# Altium project STM32_ExamplePCB.PrjPcb
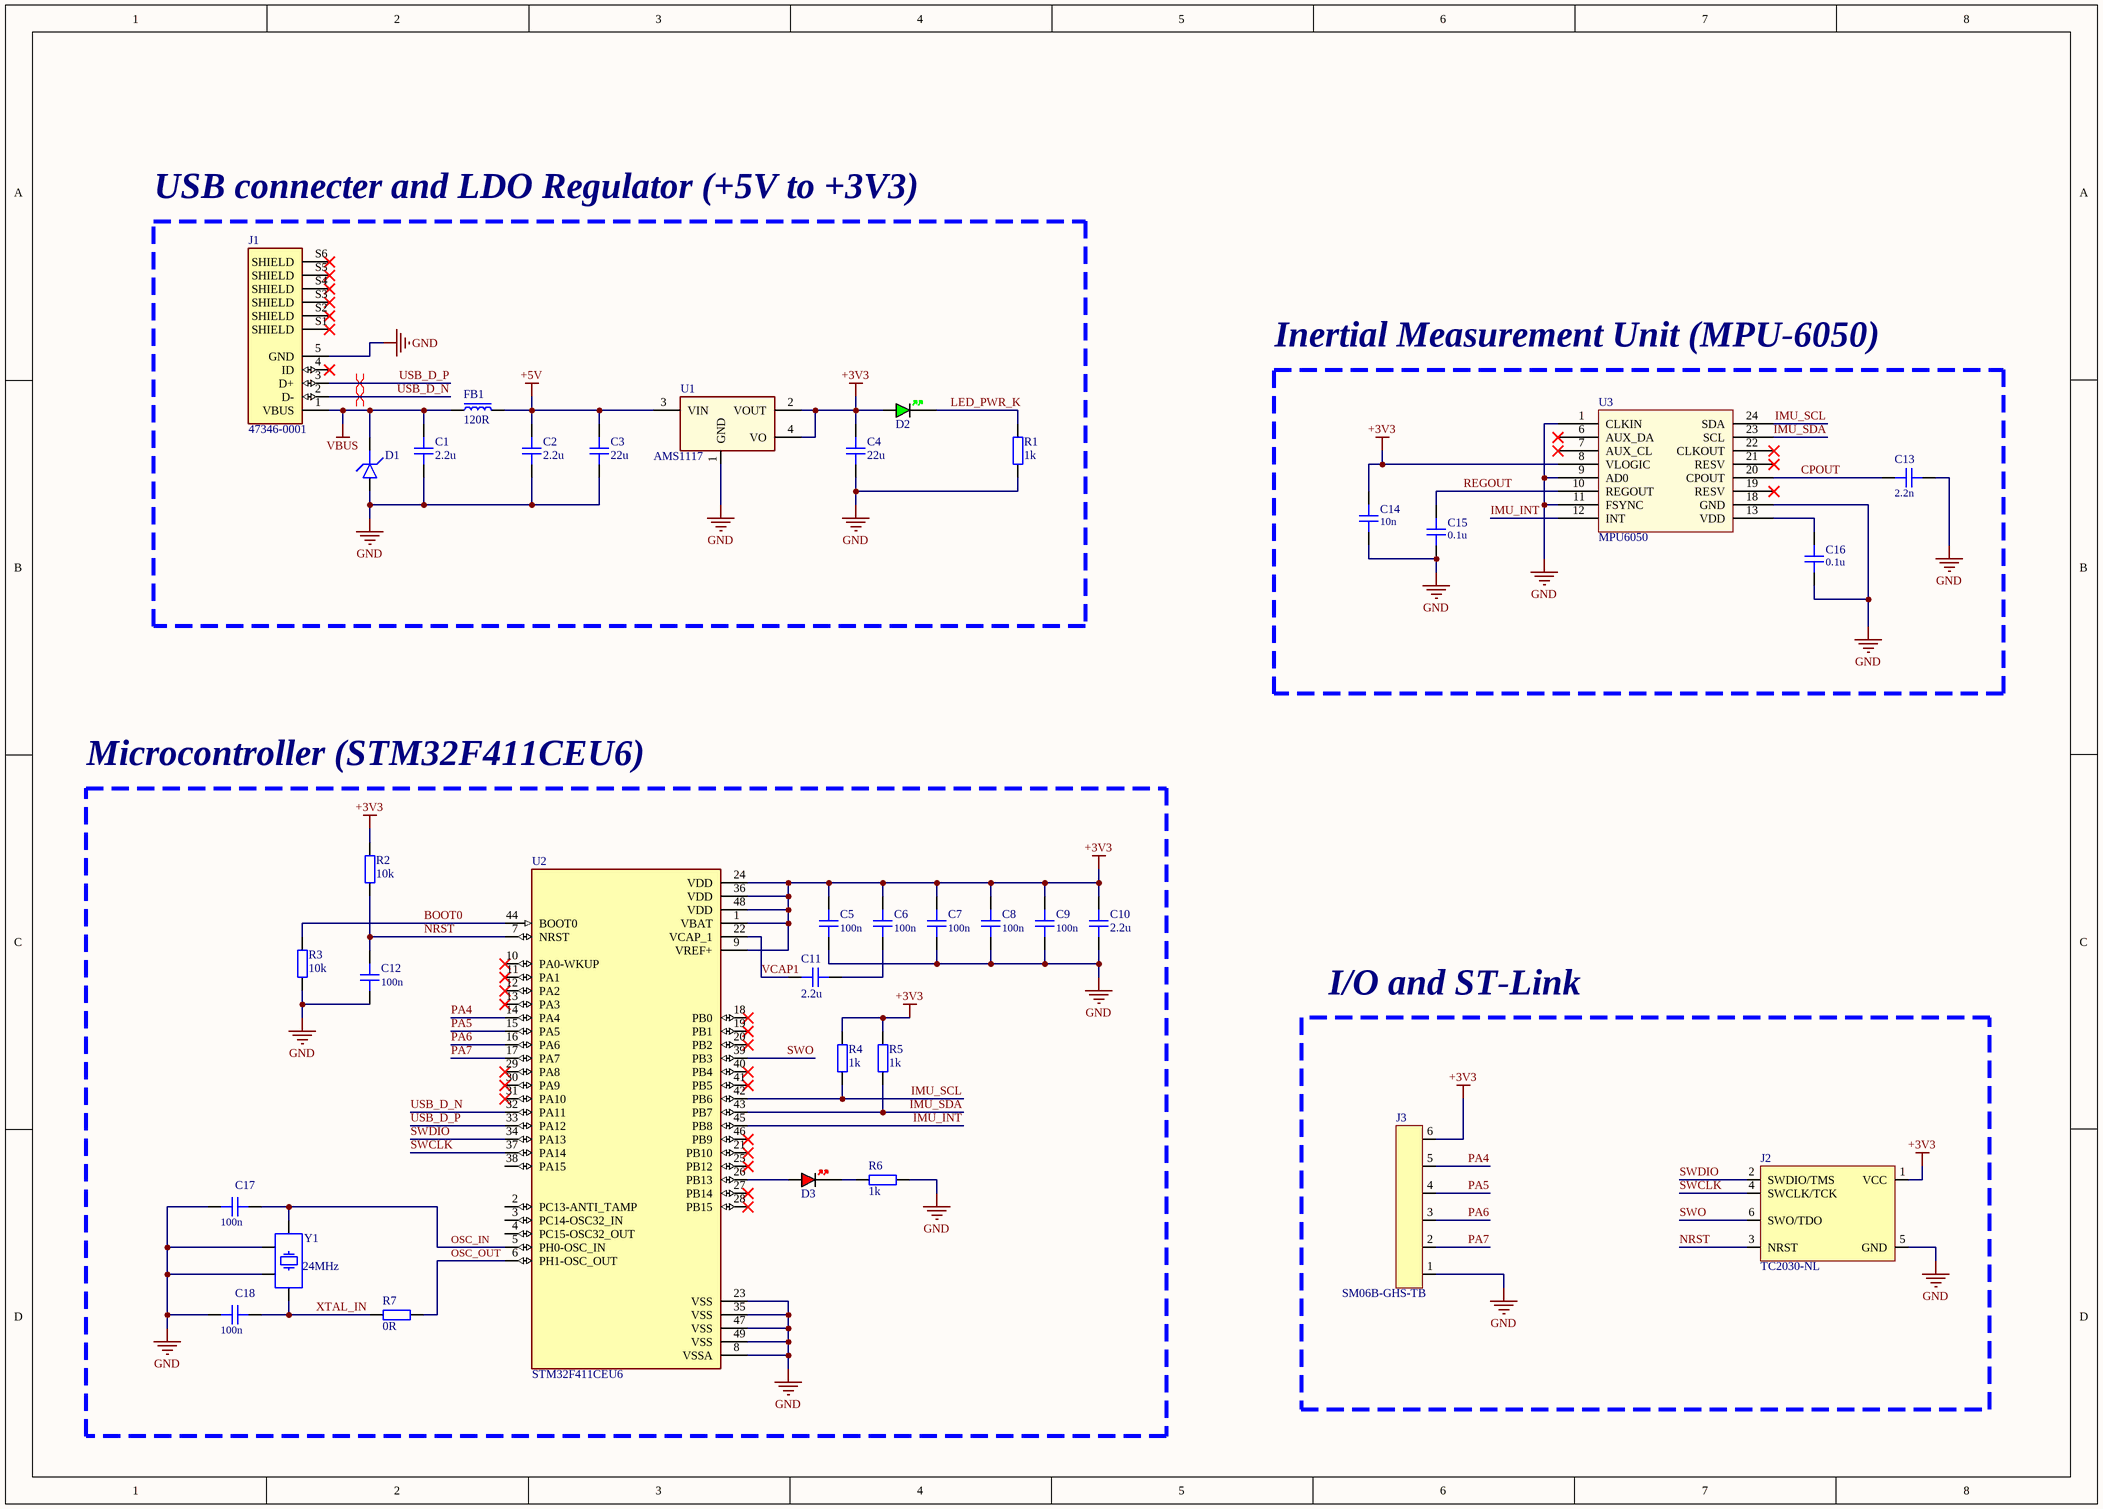
[diagram p0: STM32_Shematic.SchDoc]
1 sheet, 36 parts. Net scope: global (net labels, ports and power ports of the same name join across sheets).
Board file: PCB1_STM32.PcbDoc

## Sheet STM32_Shematic.SchDoc
size A3; SheetNumber: 1; SheetTotal: 1

### Parts
C1  2.2u  [CAP_0603]
C2  2.2u  [CAP_0603]
C3  22u  [CAP_0805]
C4  22u  [CAP_0805]
C5  100n  [CAP_0402]
C6  100n  [CAP_0402]
C7  100n  [CAP_0402]
C8  100n  [CAP_0402]
C9  100n  [CAP_0402]
C10  2.2u  [CAP_0603]
C11  2.2u  [CAP_0603]
C12  100n  [CAP_0402]
C13  2.2n  [CAP_0402]
C14  10n  [CAP_0402]
C15  0.1u  [CAP_0402]
C16  0.1u  [CAP_0402]
C17  100n  [CAP_0402]
C18  100n  [CAP_0402]
D1  (no value)  [D_0402]
D2  GREEN  [LED_0402_GREEN]  (value not drawn)
D3  RED  [LED_0402_RED]  (value not drawn)
FB1  120R  [FB_0603]
J1  47346-0001  [MOLEX_47346-0001]
J2  TC2030-NL  [TC2030-NL-FP]  (no BOM)
J3  SM06B-GHS-TB  [SM06B-GHS-TB]
R1  1k  [RES_0402]
R2  10k  [RES_0402]
R3  10k  [RES_0402]
R4  1k  [RES_0402]
R5  1k  [RES_0402]
R6  1k  [RES_0402]
R7  0R  [RES_0402]
U1  AMS1117  [SOT-223]
U2  STM32F411CEU6  [QFN50P700X700X60-49N]
U3  MPU6050
Y1  24MHz  [XTAL_3225]

### Blocks framed on the sheet
USB connecter and LDO Regulator (+5V to +3V3): C1-C4 D1 D2 FB1 J1 R1 U1
Inertial Measurement Unit (MPU-6050): C13-C16 U3
Microcontroller (STM32F411CEU6): C5-C12 C17 C18 D3 R2-R7 U2 Y1
I/O and ST-Link: J2 J3

### Nets
+3V3: C4.2 C5.2 C6.2 C7.2 C8.2 C9.2 C10.2 C14.2 D2.A J2.1(VCC) J3.6 R2.2 R4.1 R5.1 U1.2(VOUT) U1.4(VO) U2.1(VBAT) U2.9(VREF+) U2.24(VDD) U2.36(VDD) U2.48(VDD) U3.8(VLOGIC)
+5V: C2.2 C3.2 FB1.2 U1.3(VIN)
GND: C1.1 C2.1 C3.1 C4.1 C5.1 C7.1 C8.1 C9.1 C10.1 C12.1 C13.2 C14.1 C15.2 C16.2 C17.2 C18.2 D1.A J1.5(GND) J2.5(GND) J3.1 R1.1 R3.1 R6.1 U1.1(GND) U2.8(VSSA) U2.23(VSS) U2.35(VSS) U2.47(VSS) U2.49(VSS) U3.1(CLKIN) U3.9(AD0) U3.11(FSYNC) U3.18(GND) Y1.2 Y1.4
VBUS: C1.2 D1.K FB1.1 J1.1(VBUS)
BOOT0: R3.2 U2.44(BOOT0)
CPOUT: C13.1 U3.20(CPOUT)
IMU_INT: U2.45(PB8) U3.12(INT)
IMU_SCL: R4.2 U2.42(PB6) U3.24(SDA)
IMU_SDA: R5.2 U2.43(PB7) U3.23(SCL)
LED_PWR_K: D2.K R1.2
NRST: C12.2 J2.3(NRST) R2.1 U2.7(NRST)
OSC_IN: C17.1 U2.5(PH0-OSC_IN) Y1.1
OSC_OUT: R7.1 U2.6(PH1-OSC_OUT)
PA4: J3.5 U2.14(PA4)
PA5: J3.4 U2.15(PA5)
PA6: J3.3 U2.16(PA6)
PA7: J3.2 U2.17(PA7)
REGOUT: C15.1 U3.10(REGOUT)
SWCLK: J2.4(SWCLK/TCK) U2.37(PA14)
SWDIO: J2.2(SWDIO/TMS) U2.34(PA13)
SWO: J2.6(SWO/TDO) U2.39(PB3)
USB_D_N: J1.2(D-) U2.32(PA11)
USB_D_P: J1.3(D+) U2.33(PA12)
VCAP1: C11.2 U2.22(VCAP_1)
XTAL_IN: C18.1 R7.2 Y1.3
NetC6_1: C6.1 C11.1
NetC16_1: C16.1 U3.13(VDD)
NetD3_A: D3.A U2.26(PB13)
NetD3_K: D3.K R6.2

Not connected (* = marked no-connect by the designer): J1 4(ID)* S1(SHIELD)* S2(SHIELD)* S3(SHIELD)* S4(SHIELD)* S5(SHIELD)* S6(SHIELD)*; U2 2(PC13-ANTI_TAMP) 3(PC14-OSC32_IN) 4(PC15-OSC32_OUT) 10(PA0-WKUP)* 11(PA1)* 12(PA2)* 13(PA3)* 18(PB0)* 19(PB1)* 20(PB2)* 21(PB10)* 25(PB12)* 27(PB14)* 28(PB15)* 29(PA8)* 30(PA9)* 31(PA10)* 38(PA15) 40(PB4)* 41(PB5)* 46(PB9)*; U3 6(AUX_DA)* 7(AUX_CL)* 19(RESV)* 21(RESV)* 22(CLKOUT)*

### Layout directives
differential pair: USB_D_N, USB_D_P

### Library data of the parts
C1 C2 C10 C11 = CAP_0603_16V: Capacitor SMD 0603 16V
C3 C4 = CAP_0805_16V: Capacitor SMD 0805 16V
C5-C9 C12-C18 = CAP_0402_16V: Capacitor SMD 0402 16V
D1 = D_TVS_0402: Diode TVS / ESD 0402
D2 = LED_0402_GREEN: LED 0402 GREEN SMD
D3 = LED_0402_RED: LED 0402 RED SMD
FB1 = FB_0603: Ferrite Bead SMD 0603
J1 = 47346-0001: Conn Data USB Micro B w/Flange SMT Bottom Mnt LF | Molex Incorporated 47346-0001; SnapEDA_Link: https://www.snapeda.com/parts/47346-0001/Molex/view-part/?ref=snap; Package: None; Value: *; MF: Molex; MP: 47346-0001; Check_prices: https://www.snapeda.com/parts/47346-0001/Molex/view-part/?ref=eda
J2 = TC2030-NL: Tag-Connect No-Solder SWD Debug Connector (No Legs) DO NOT PLACE; Manufacturer: Tag-Connect; Manufacturer Part Number: TC2030-NL-FP
J3 = SM06B-GHS-TB: Header Connector 6 Position 1.25MM Pitch SMD Horizontal JST GH; Manufacturer: JST; Manufacturer Part Number: SM06B-GHS-TB
R1-R7 = RES_0402: Resistor SMD 0402
U1 = AMS1117: 1A LDO Voltage Regulator, ADJ or fixed 1.5/1.8/2.5/2.85/3.3/5V
U2 = STM32F411CEU6: High-performance access line, ARM Cortex-M4 core with DSP and FPU, 512 Kbytes Flash, 100 MHz CPU, ART Accelerator; Package: None; Availability: Unavailable; Value: *; MP: STM32F411CEU6; Price: None
Y1 = TSX-3225_24.0000MF15X-AC: Crystal SMD 24MHz 10PPM 7pF 3225; Manufacturer: Epson; Manufacturer Number: TSX-3225 24.0000MF15X-AC; ESR: 40R; Value: 24MHz; Type: XTAL; Load Capacitance: 7pF